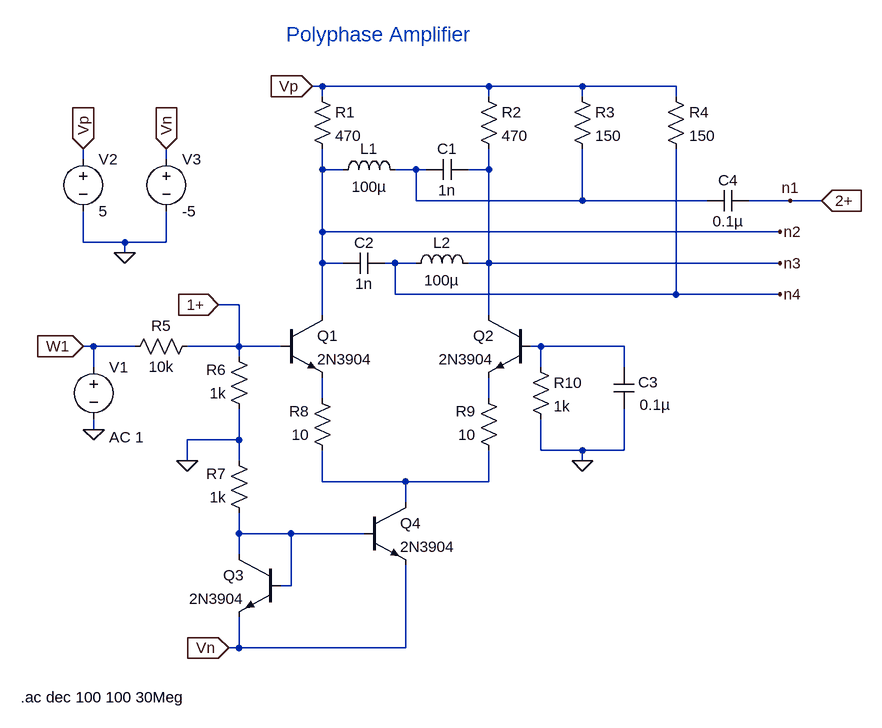
[diagram p0: schematic polyphase_amp_ltspice.asc]
polyphase_amp_ltspice.asc, the LTspice schematic file:
Version 4
SHEET 1 956 1112
WIRE 96 128 80 128
WIRE 352 128 96 128
WIRE 496 128 352 128
WIRE 640 128 496 128
WIRE 96 144 96 128
WIRE 352 144 352 128
WIRE 496 144 496 128
WIRE 640 144 640 128
WIRE -272 240 -272 224
WIRE -144 240 -144 224
WIRE 96 256 96 224
WIRE 128 256 96 256
WIRE 240 256 208 256
WIRE 256 256 240 256
WIRE 352 256 352 224
WIRE 352 256 320 256
WIRE 240 304 240 256
WIRE 496 304 496 224
WIRE 496 304 240 304
WIRE 688 304 496 304
WIRE 816 304 752 304
WIRE 864 304 816 304
WIRE 96 352 96 256
WIRE 800 352 96 352
WIRE -272 368 -272 320
WIRE -208 368 -272 368
WIRE -144 368 -144 320
WIRE -144 368 -208 368
WIRE -208 384 -208 368
WIRE 96 400 96 352
WIRE 128 400 96 400
WIRE 208 400 192 400
WIRE 240 400 208 400
WIRE 352 400 352 256
WIRE 352 400 320 400
WIRE 800 400 352 400
WIRE 208 448 208 400
WIRE 640 448 640 224
WIRE 640 448 208 448
WIRE 800 448 640 448
WIRE -32 464 -64 464
WIRE 96 480 96 400
WIRE 352 480 352 400
WIRE -256 528 -272 528
WIRE -192 528 -256 528
WIRE -32 528 -32 464
WIRE -32 528 -112 528
WIRE 32 528 -32 528
WIRE 432 528 416 528
WIRE 560 528 432 528
WIRE -32 544 -32 528
WIRE -256 560 -256 528
WIRE 432 560 432 528
WIRE 560 560 560 528
WIRE 96 608 96 576
WIRE 352 608 352 576
WIRE -256 656 -256 640
WIRE -32 672 -32 624
WIRE -32 672 -112 672
WIRE 432 688 432 640
WIRE 496 688 432 688
WIRE 560 688 560 624
WIRE 560 688 496 688
WIRE -112 704 -112 672
WIRE -32 704 -32 672
WIRE 496 704 496 688
WIRE 96 736 96 688
WIRE 224 736 96 736
WIRE 352 736 352 688
WIRE 352 736 224 736
WIRE 224 768 224 736
WIRE -32 816 -32 784
WIRE 48 816 -32 816
WIRE 160 816 48 816
WIRE -32 848 -32 816
WIRE 48 896 48 816
WIRE 48 896 32 896
WIRE -32 992 -32 944
WIRE -32 992 -48 992
WIRE 224 992 224 864
WIRE 224 992 -32 992
FLAG 80 128 Vp
IOPIN 80 128 In
FLAG 864 304 2+
IOPIN 864 304 In
FLAG -272 528 W1
IOPIN -272 528 In
FLAG 496 704 0
FLAG -112 704 0
FLAG -48 992 Vn
IOPIN -48 992 In
FLAG -256 656 0
FLAG -272 224 Vp
IOPIN -272 224 In
FLAG -144 224 Vn
IOPIN -144 224 In
FLAG -208 384 0
FLAG -64 464 1+
IOPIN -64 464 In
FLAG 800 352 n2
FLAG 800 400 n3
FLAG 800 448 n4
FLAG 816 304 n1
SYMBOL res 80 128 R0
SYMATTR InstName R1
SYMATTR Value 470
SYMBOL res 336 128 R0
SYMATTR InstName R2
SYMATTR Value 470
SYMBOL res 480 128 R0
SYMATTR InstName R3
SYMATTR Value 150
SYMBOL res 624 128 R0
SYMATTR InstName R4
SYMATTR Value 150
SYMBOL ind 112 272 R270
WINDOW 0 32 56 VTop 2
WINDOW 3 5 56 VBottom 2
SYMATTR InstName L1
SYMATTR Value 100µ
SYMBOL cap 320 240 R90
WINDOW 0 0 32 VBottom 2
WINDOW 3 32 32 VTop 2
SYMATTR InstName C1
SYMATTR Value 1n
SYMBOL cap 192 384 R90
WINDOW 0 0 32 VBottom 2
WINDOW 3 32 32 VTop 2
SYMATTR InstName C2
SYMATTR Value 1n
SYMBOL cap 752 288 R90
WINDOW 0 0 32 VBottom 2
WINDOW 3 32 32 VTop 2
SYMATTR InstName C4
SYMATTR Value 0.1µ
SYMBOL ind 224 416 R270
WINDOW 0 32 56 VTop 2
WINDOW 3 5 56 VBottom 2
SYMATTR InstName L2
SYMATTR Value 100µ
SYMBOL npn 32 480 R0
SYMATTR InstName Q1
SYMATTR Value 2N3904
SYMBOL npn 416 480 M0
SYMATTR InstName Q2
SYMATTR Value 2N3904
SYMBOL res -96 512 R90
WINDOW 0 0 56 VBottom 2
WINDOW 3 32 56 VTop 2
SYMATTR InstName R5
SYMATTR Value 10k
SYMBOL res -16 640 R180
WINDOW 0 36 76 Left 2
WINDOW 3 36 40 Left 2
SYMATTR InstName R6
SYMATTR Value 1k
SYMBOL res -16 800 R180
WINDOW 0 36 76 Left 2
WINDOW 3 36 40 Left 2
SYMATTR InstName R7
SYMATTR Value 1k
SYMBOL res 112 704 R180
WINDOW 0 36 76 Left 2
WINDOW 3 36 40 Left 2
SYMATTR InstName R8
SYMATTR Value 10
SYMBOL res 368 704 R180
WINDOW 0 36 76 Left 2
WINDOW 3 36 40 Left 2
SYMATTR InstName R9
SYMATTR Value 10
SYMBOL res 416 544 R0
SYMATTR InstName R10
SYMATTR Value 1k
SYMBOL cap 576 624 R180
WINDOW 0 -37 41 Left 2
WINDOW 3 -8 6 Right 2
SYMATTR InstName C3
SYMATTR Value 0.1µ
SYMBOL npn 32 848 M0
SYMATTR InstName Q3
SYMATTR Value 2N3904
SYMBOL npn 160 768 R0
SYMATTR InstName Q4
SYMATTR Value 2N3904
SYMBOL voltage -256 544 R0
WINDOW 123 24 124 Left 2
WINDOW 39 0 0 Left 0
SYMATTR InstName V1
SYMATTR Value ""
SYMATTR Value2 AC 1
SYMBOL voltage -272 224 R0
SYMATTR InstName V2
SYMATTR Value 5
SYMBOL voltage -144 224 R0
SYMATTR InstName V3
SYMATTR Value -5
TEXT 40 48 Left 3 ;Polyphase Amplifier
TEXT -368 1068 Left 2 !.ac dec 100 100 30Meg

The netlist it stands for:
* polyphase_amp_ltspice.asc
R1 Vp n2 470
R2 Vp n3 470
R3 Vp N001 150
R4 Vp n4 150
L1 n2 N001 100µ
C1 n3 N001 1n
C2 n4 n2 1n
C4 n1 N001 0.1µ
L2 n4 n3 100µ
Q1 n2 1+ N003 0 2N3904
Q2 n3 N002 N004 0 2N3904
R5 1+ W1 10k
R6 0 1+ 1k
R7 N006 0 1k
R8 N005 N003 10
R9 N005 N004 10
R10 N002 0 1k
C3 0 N002 0.1µ
Q3 N006 N006 Vn 0 2N3904
Q4 N005 N006 Vn 0 2N3904
V1 W1 0 AC 1
V2 Vp 0 5
V3 Vn 0 -5
.model NPN NPN
.model PNP PNP
.lib standard.bjt
* Polyphase Amplifier
.ac dec 100 100 30Meg
.backanno
.end